# EAGLE design Desain_hardware_GasMeter (EAGLE 9.6.2)
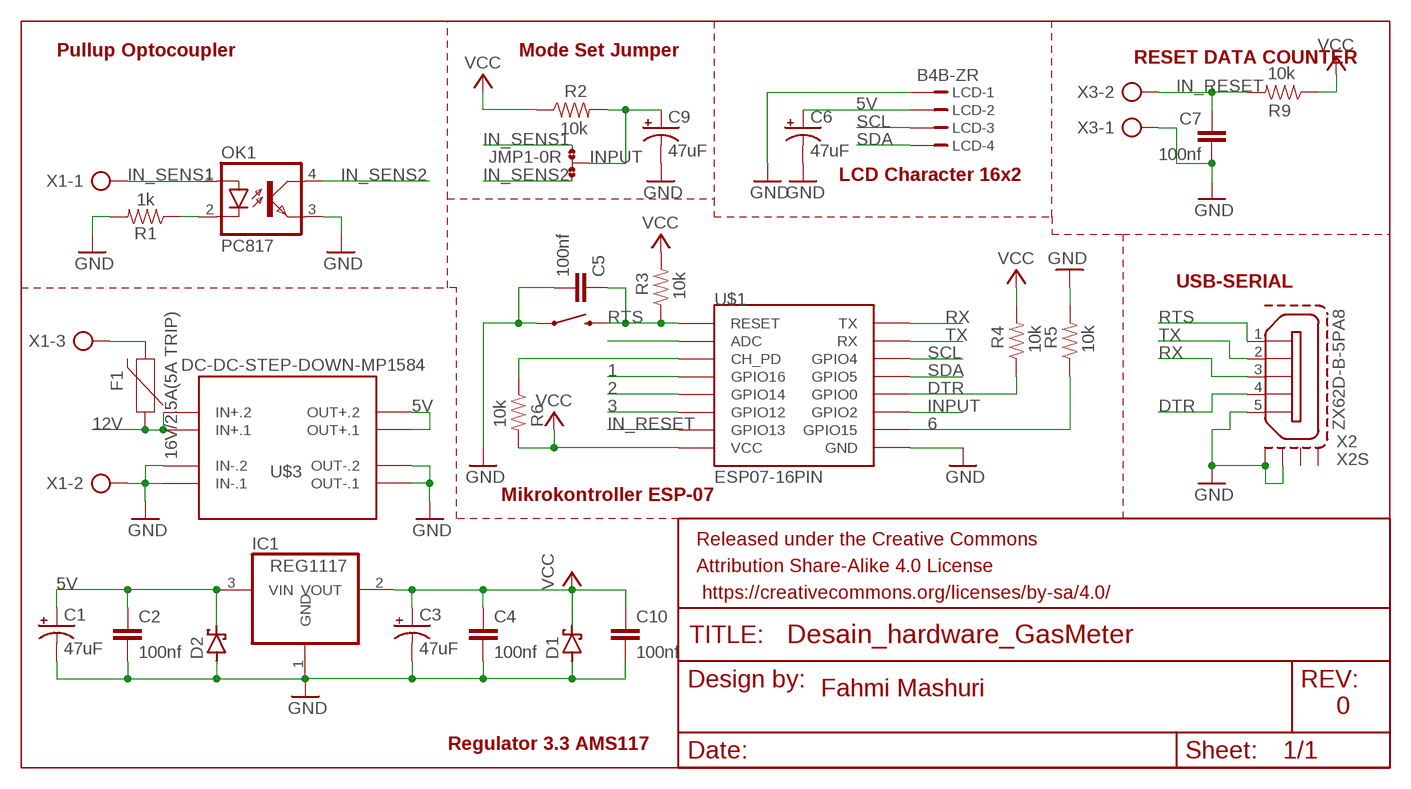
[diagram p0: schematic, sheet 1]

## Parts
C1  47uF  47UF-POLAR-EIA3528-10V-10%  [EIA3528]
C2  100nf  39NF-0805-50V-10%  [0805]
C3  47uF  47UF-POLAR-EIA3528-10V-10%  [EIA3528]
C4  100nf  39NF-0805-50V-10%  [0805]
C5  100nf  39NF-0805-50V-10%  [0805]
C6  47uF  47UF-POLAR-EIA3528-10V-10%  [EIA3528]
C7  100nf  39NF-0805-50V-10%  [0805]
C9  47uF  47UF-POLAR-EIA3528-10V-10%  [EIA3528]
C10  100nf  39NF-0805-50V-10%  [0805]
D1  SCHOTTKY-DIODESMD  [SMB]
D2  SCHOTTKY-DIODESMD  [SMB]
F1  16V/2.5A(5A TRIP)  PPTC_16V_2.5A  [1812]
FRAME1  FRAME-LETTER  [CREATIVE_COMMONS]
IC1  REG1117  [SOT223]
JMP1  0R-JUMPA  [A0R-JMP]
LCD  B4B-ZR  [B4B-ZR]
OK1  PC817  [DIL04]
R1  1k  0.1OHM-1210-1/2W-1%  [1210]
R2  10k  0.3OHM-0805-1/8W-1%  [0805]
R3  10k  0.3OHM-0805-1/8W-1%  [0805]
R4  10k  0.3OHM-0805-1/8W-1%  [0805]
R5  10k  0.3OHM-0805-1/8W-1%  [0805]
R6  10k  0.3OHM-0805-1/8W-1%  [0805]
R9  10k  0.3OHM-0805-1/8W-1%  [0805]
U$1  ESP07-16PIN  [ESP07-16PIN]
U$2  MOMENTARY-SWITCH-SPST-PTH-6.0MM  [TACTILE_SWITCH_PTH_6.0MM]
U$3  DC-DC-STEP-DOWN-MP1584  [DC-DC-STEP-DOWN-MP1584]
X1  AK500/3  [AK500/3]
X2  ZX62D-B-5PA8  [ZX62D-B-5PA8]
X3  AK500/2  [AK500/2]

## Nets
1: U$1.GPIO16
2: U$1.GPIO14
3: U$1.GPIO12
5V: C1.A(+) C2.1 C6.A(+) D2.C IC1.3(VIN) LCD.2 U$3.OUT+.1 U$3.OUT+.2
6: R5.1 U$1.GPIO15
12V: F1.1 U$3.IN+.1 U$3.IN+.2
DTR: R4.1 U$1.GPIO0 X2.4
GND: C1.C(-) C2.2 C3.C(-) C4.2 C5.2 C6.C(-) C7.2 C9.C(-) C10.2 D1.A D2.A IC1.1(GND) LCD.1 OK1.3(EMIT) R1.2 R5.2 U$1.GND U$2.1 U$3.IN-.1 U$3.IN-.2 U$3.OUT-.1 U$3.OUT-.2 X1.2 X2.5 X2.S1 X2.S2 X3.1
IN_RESET: C7.1 R9.2 U$1.GPIO13 X3.2
IN_SENS1: JMP1.1 OK1.1(A) X1.1
IN_SENS2: JMP1.3 OK1.4(COL)
INPUT: C9.A(+) JMP1.2 R2.2 U$1.GPIO2
N$1: R6.1 U$1.CH_PD
N$2: F1.2 X1.3
N$4: OK1.2(C) R1.1
N$10: U$1.ADC
RTS: C5.1 R3.1 U$1.REST(RESET) U$2.3 X2.1
RX: U$1.TX X2.3
SCL: LCD.3 U$1.GPIO4
SDA: LCD.4 U$1.GPIO5
TX: U$1.RX X2.2
VCC: C3.A(+) C4.1 C10.1 D1.C IC1.2(VOUT) R2.1 R3.2 R4.2 R6.2 R9.1 U$1.VCC
Unconnected: X2.S3 X2.S4

## Notes on the sheet
- Pullup Optocoupler | Mode Set Jumper
- RESET DATA COUNTER
- LCD Character 16x2
- USB-SERIAL
- Mikrokontroller ESP-07
- Fahmi Mashuri
- 0
- Regulator 3.3 AMS117

## Library data of the parts
C1 C3 C6 C9 = SparkFun-Capacitors:47UF-POLAR: 47µF polarized capacitors A capacitor is a passive two-terminal electrical component used to store electrical energy temporarily in an electric field.; PROD_ID: CAP-08310
C2 C4 C5 C7 C10 = SparkFun-Capacitors:39NF: 39nF ceramic capacitors A capacitor is a passive two-terminal electrical component used to store electrical energy temporarily in an electric field.; PROD_ID: CAP-15816; VALUE: 39nF
D1 D2 = diode:SCHOTTKY-DIODE: Schottky Diode
F1 = SparkFun-Fuses:PPTC: Resettable Fuse PPTC Resettable Fuse. Really a sort of resistor with a polymeric positive temperature coefficient whose resistance increases dramatically with an increase in temperature. When heated by the power passing through the resistance rises causing the current to be limited, protecting the circuit. This is achieved by the transition of the polymer from a crystalline to an amorphous state where the conductive carbon separates breaking the conductive pathways found in the cool crystalline structure. When a PPTC cools back down it resumes conducting letting the circuit turn back on. SparkFun Products: SparkFun RedBoard - Programmed with Arduino <https://www.sparkfun.com/products/12757> Pro Micro - 5V/16MHz <https://www.sparkfun.com/products/12640> Arduino Pro 328 - 5V/16MHz <https://www.sparkfun.com/products/10915> MP3 Trigger <https://www.sparkfun.com/products/13720>; PROD_ID: RES-14390
FRAME1 = SparkFun-Aesthetics:FRAME-LETTER: Schematic Frame - Letter Standard 8.5x11 US Letter frame
IC1 = burr-brown:REG1117: 800mA and 1A Low Dropout (LDO) Positive Regulator 1.8V, 2.5V, 2.85V, 3.3V, 5V, and Adj; MPN: REG1117; OC_FARNELL: 1097566; OC_NEWARK: 14P6981
JMP1 = jump-0r-smd:0R-JUMP: SMD 0R 0805 Jumper
LCD = con-jst:?4B-ZR: ZH CONNECTOR 1.5 mm, 4 pin 1 row Source: http://www.jst.com .. eZH.pdf; MF: FARNELL; MPN: B4B-ZR(LF)(SN); OC_FARNELL: 1830916; OC_NEWARK: 37K9960
OK1 = optocoupler:PC817: SHARP OPTO COUPLER; MPN: PC817X4J000F; OC_FARNELL: 9707727; OC_NEWARK: 97K7059
R1 = SparkFun-Resistors:0.1OHM: 0.1Ω resistor A resistor is a passive two-terminal electrical component that implements electrical resistance as a circuit element. Resistors act to reduce current flow, and, at the same time, act to lower voltage levels within circuits. - Wikipedia; PROD_ID: RES-12374; VALUE: 0.1
R2-R6 R9 = SparkFun-Resistors:0.3OHM: 0.3Ω resistor A resistor is a passive two-terminal electrical component that implements electrical resistance as a circuit element. Resistors act to reduce current flow, and, at the same time, act to lower voltage levels within circuits. - Wikipedia; PROD_ID: RES-11622; VALUE: 0.3
U$1 = esp8266modules:ESP07-16PIN: ESP8266 Wifi module 07 - 16 pins; DIMENSIONS: 22.0 x 16.0 mm; PINS: 16; PITCH: 0.078" / 2 mm
U$2 = SparkFun-Switches:MOMENTARY-SWITCH-SPST: Momentary Switch (Pushbutton) - SPST Normally-open (NO) SPST momentary switches (buttons, pushbuttons). Variants PTH-12MM - 12mm square, through-hole Momentary Pushbutton Switch - 12mm Square <https://www.sparkfun.com/products/9190> (COM-09190) PTH-6.0MM, PTH-6.0MM-KIT - 6.0mm square, through-hole Mini Pushbutton Switch <https://www.sparkfun.com/products/97> (COM-00097) KIT package intended for soldering kit's - only one side of pads' copper is exposed. PTH-RIGHT-ANGLE-KIT - Right-angle, through-hole Right Angle Tactile Button <https://www.sparkfun.com/products/10791> - Used on SparkFun BigTime Watch Kit <https://www.sparkfun.com/products/11734> SMD-12MM - 12mm square, surface-mount Tactile Button - SMD (12mm) <https://www.sparkfun.com/products/12993> (COM-12993) Used on SparkFun PicoBoard <https://www.sparkfun.com/products/11888> SMD-4.5MM - 4.5mm Square Trackball Switch Used on SparkFun Blackberry Trackballer Breakout <https://www.sparkfun.com/products/13169> SMD-4.6MMX2.8MM - 4.60mm x 2.80mm, surface mount Used on SparkFun SAMD21 Mini Breakout <https://www.sparkfun.com/products/13664> SMD-5.2MM, SMD-5.2-REDUNDANT - 5.2mm square, surface-mount Mini Pushbutton Switch - SMD <https://www.sparkfun.com/products/8720> (COM-08720) Used on Arduino Pro Mini <https://www.sparkfun.com/products/11114> REDUNDANT package connects both switch circuits together SMD-6.0X3.5MM - 6.0 x 3.5mm, surface mount Momentary Reset Switch SMD <https://www.sparkfun.com/products/8229> (COM-08229) SMD-6.2MM-TALL - 6.2mm square, surface mount Tactile Button - SMD (6mm) <https://www.sparkfun.com/products/12992> Used on SparkFun Digital Sandbox <https://www.sparkfun.com/products/12651> SMD-RIGHT-ANGLE - Right-angle, surface mount Used on SparkFun Block for Intel® Edison - Arduino <https://www.sparkfun.com/products/13036>; PROD_ID: SWCH-08441; SF_SKU: COM-00097
U$3 = diy-modules:DC-DC-STEP-DOWN-MP1584: DC/DC Step-Down Regulator based on MP1584 chip MP1584 datasheet available here: http://www.haoyuelectronics.com/Attachment/MP1584/MP1584.pdf Click here to find device on ebay.com <http://www.ebay.com/sch/mp1584+module>
X1 = con-ptr500:AK500/3: CONNECTOR; OC_FARNELL: unknown; OC_NEWARK: unknown
X2 = zx62d-b-5pa8-oshpark_10:ZX62D-B-5PA8: Micro USB Type B Connector - Standard, Shell Through Hole Source: http://www.hirose.co.jp/cataloge_hp/ed_ZX_20140804.pdf; MF: Hirose; MPN: ZX62D-B-5PA8; OC_FARNELL: 2300438; OC_NEWARK: 69W0712
X3 = con-ptr500:AK500/2: CONNECTOR; OC_FARNELL: unknown; OC_NEWARK: unknown

## Board
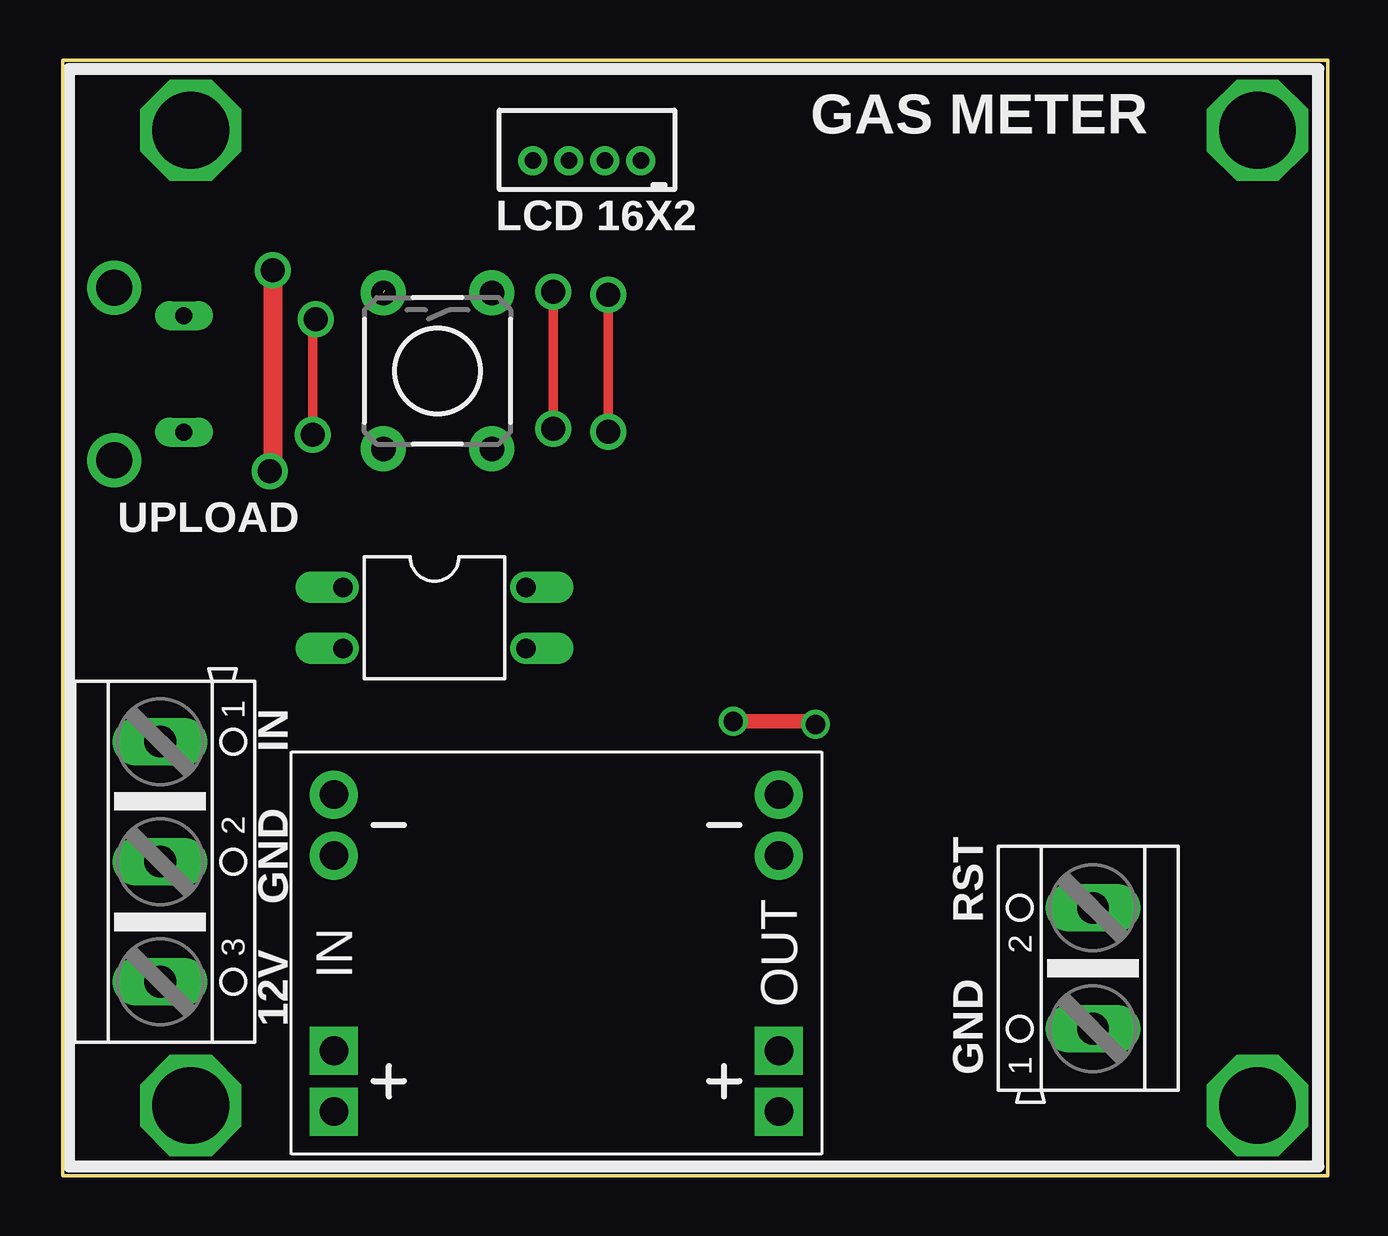
[diagram p1: board, top side]
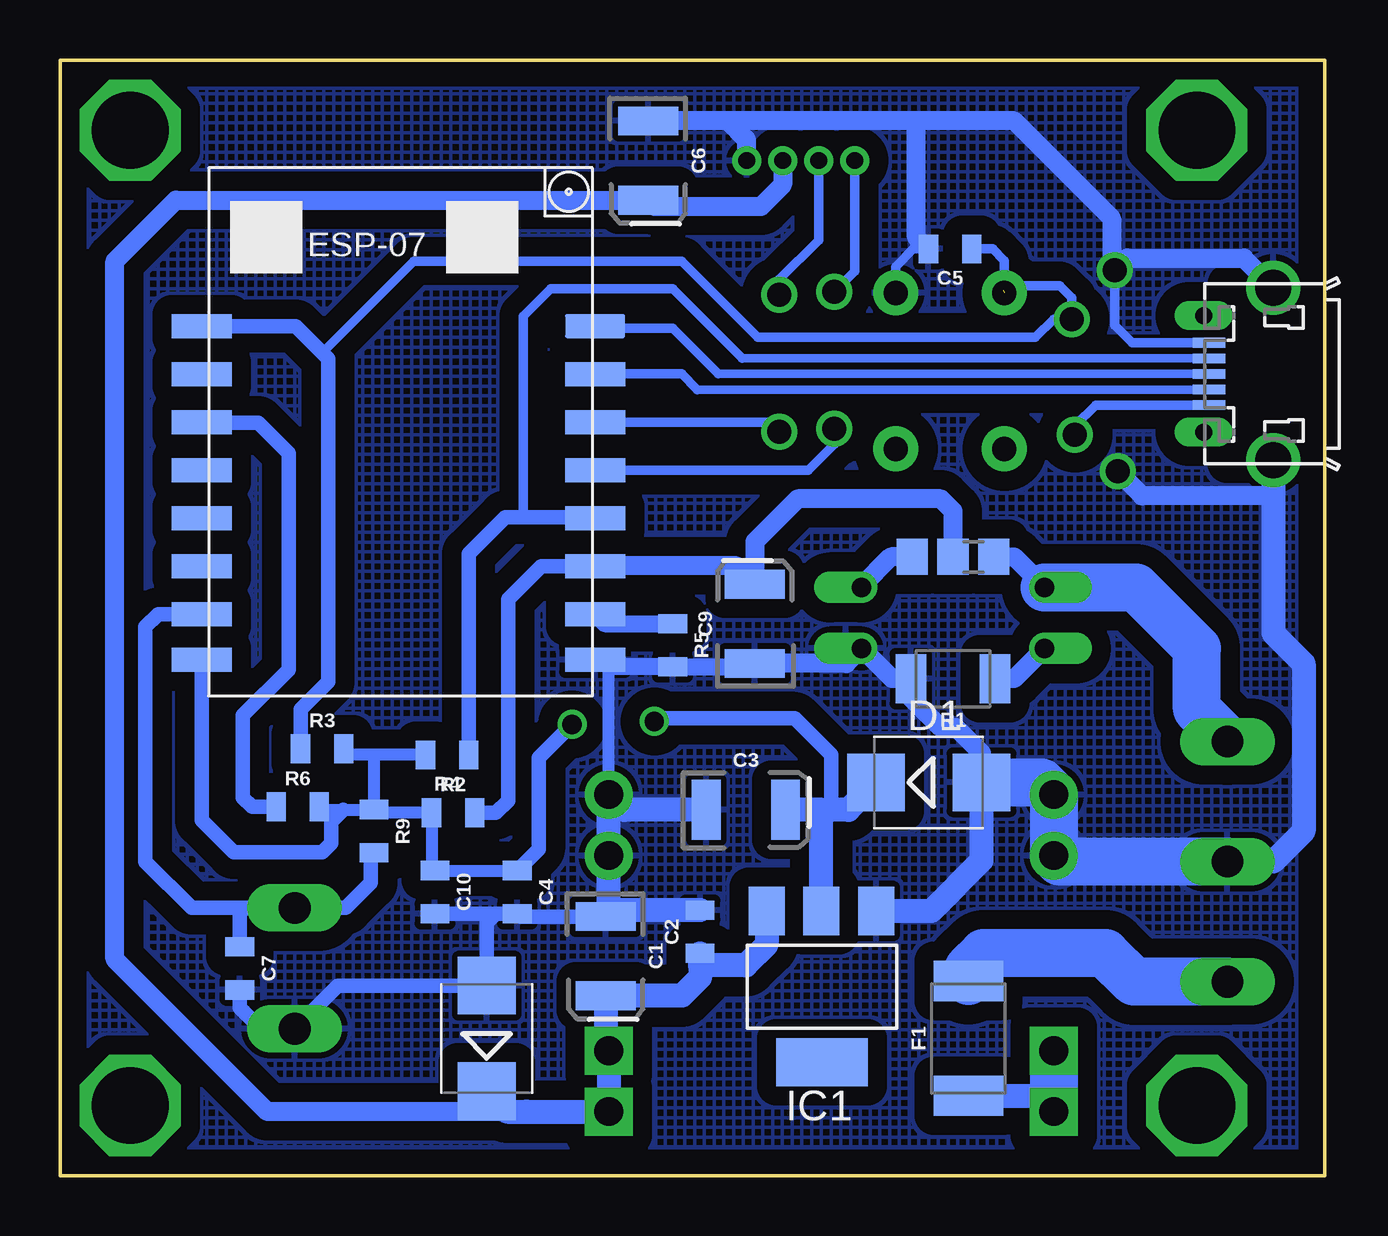
[diagram p2: board, bottom side, seen from below]

Size 52.7 x 46.48 mm. Coordinates in mm from the lower left corner, seen from the top.
Outline: 0,0 52.7,0 52.7,46.48 0,46.48 0,0
Copper layers (1*16): Top 0.035mm / dielectric 0.15mm / Bottom 0.035mm
Design rules "default": minimum track width 6mil, minimum drill 0.35mm, track to track 6mil, track to pad 6mil, pad to pad 6mil, via to via 6mil, smd to smd 6mil, copper to edge 40mil, drill to drill 6mil, minimum pad ring 10mil, minimum via ring 8mil, stop-mask expansion 4mil, vias tented up to drill 0mil, thermal gap 10mil

### Footprints (pad centres in the part's own frame; a part is rotated, then mirrored left to right if it is on the bottom)
EIA3528 = smd 1.2 x 2.5: A 1.65,0; C -1.65,0
0805 = smd 0.8 x 1.2: 1 -0.9,0; 2 0.9,0
SMB = smd 2.4 x 2.4: A 2.2,0; C -2.2,0
1812 = smd 1.676 x 2.896: 1 -2.388,0; 2 2.388,0
SOT223 = smd 1.499 x 2.007: 1 -2.261,-3.15; 2 0.025,-3.15; 3 2.311,-3.15 | smd 3.81 x 2.007: 4 0,3.15
A0R-JMP = smd 1.5 x 1.3: 1 0,1.7; 2 0,0; 3 0,-1.7
B4B-ZR = drill 0.7 pad 1.1: 1 -2.25,0; 2 -0.75,0; 3 0.75,0; 4 2.25,0
DIL04 = drill 0.813 offset: 1 -1.27,-3.81; 2 1.27,-3.81; 3 1.27,3.81; 4 -1.27,3.81
1210 = smd 1.27 x 2.06: 1 -1.755,0; 2 1.755,0
ESP07-16PIN = smd 2.5 x 1: ADC -8.2,3.8; CH_PD -8.2,1.8; GND 8.2,-8.105; GPIO0 8.2,-2.2; GPIO2 8.2,-4.2; GPIO4 8.2,1.8; GPIO5 8.2,-0.2; GPIO12 -8.2,-4.2; GPIO13 -8.2,-6.2; GPIO14 -8.2,-2.2; GPIO15 8.2,-6.2; GPIO16 -8.2,-0.2; REST -8.2,5.8; RX 8.2,3.8; TX 8.2,5.8; VCC -8.2,-8.105
TACTILE_SWITCH_PTH_6.0MM = drill 1.016 pad 1.88: 1 -3.251,2.261; 2 3.251,2.261; 3 -3.251,-2.261; 4 3.251,-2.261
DC-DC-STEP-DOWN-MP1584 = drill 1.2 pad 2 square: IN+.1 -9.271,-4.064; IN+.2 -9.271,-6.604; OUT+.1 9.271,-4.064; OUT+.2 9.271,-6.604 | drill 1.2 pad 2: IN-.1 -9.271,6.604; IN-.2 -9.271,4.064; OUT-.1 9.271,6.604; OUT-.2 9.271,4.064
AK500/3 = drill 1.321 long: 1 -5.004,0; 2 0,0; 3 5.004,0
ZX62D-B-5PA8 = smd 1.35 x 0.4: 1 4.825,1.3; 2 4.825,0.65; 3 4.825,0; 4 4.825,-0.65; 5 4.825,-1.3 | drill 1.5: S1 2.15,-3.6; S2 2.15,3.6 | drill 0.7 long: S3 5.05,2.425; S4 5.05,-2.425
AK500/2 = drill 1.321 long: 1 -2.515,0; 2 2.515,0

### Placement (x,y rotation side)
C1  29.97,9.14 270 bottom
C2  26.04,10.16 90 bottom
C3  24.13,15.24 0 bottom
C4  33.66,11.81 270 bottom
C5  15.62,38.61 180 bottom
C6  28.19,42.29 270 bottom
C7  45.21,8.64 270 bottom
C9  23.75,22.99 90 bottom
C10  37.08,11.81 270 bottom
D1  16.51,16.38 0 bottom
D2  34.92,5.71 90 bottom
F1  14.86,5.71 90 bottom
FRAME1  6.6,-8.51 0 top  (outside the outline)
IC1  20.96,7.87 180 bottom
JMP1  15.49,25.78 270 bottom
LCD  21.84,42.29 180 top
OK1  15.49,23.24 270 top
R1  15.49,20.7 180 bottom
R2  36.32,15.11 0 bottom
R3  41.78,17.78 0 bottom
R4  36.58,17.53 180 bottom
R5  27.18,22.1 270 bottom
R6  42.8,15.37 0 bottom
R9  39.62,14.35 270 bottom
U$1  38.61,29.59 0 bottom
U$2  15.62,33.53 270 top
U$3  20.57,9.27 0 top
X1  4.06,13.08 270 top
X2  0,33.4 180 bottom
X3  42.93,8.64 90 top

### Tracks (layer width: path | path; a pad name or v marks a point on that pad's centre or on a via)
5V
  Bottom 0.8: 33.27,2.67 44.07,2.67 50.42,9.02 50.42,38.1 47.88,40.64 C6.A 27.94,40.39 23.5,40.39 22.59,41.29 LCD.2
  Bottom 1: D2.C 34.08,2.67 33.27,2.67 U$3.OUT+.2 U$3.OUT+.1 29.97,5.33 C1.A 26.8,7.49 26.04,8.25 26.04,8.76 | C2.1 26.04,8.76 | IC1.3 23.27,9.63 24.13,8.76 26.04,8.76
6
  Bottom 0.7: U$1.GPIO15 30.02,23 R5.1
12V
  Bottom 1: F1.1 12.09,3.33 11.43,2.67 U$3.IN+.2
  Bottom 2: U$3.IN+.1 U$3.IN+.2
DTR
  Bottom 0.35: X2.4 24.27,34.05
  Bottom 0.4: 33.4,27.43 33.4,35.81 32.26,36.96 27.18,36.96 24.27,34.05
  Bottom 0.6: R4.1 35.68,25.92 34.16,27.43 33.4,27.43 31.12,27.43 30.86,27.18 30.62,27.18 U$1.GPIO0
GND  (via drill 1)
  Top 0.8: v8.76,37.72 8.76,29.46 v8.64,29.34
  Bottom 0.4: X2.5 8.03,34.7 8.76,35.43 8.76,38.1 8.64,38.23 3.38,38.23 | U$2.1 17.88,37.87 17.14,38.61 C5.2
  Bottom 0.5: U$3.OUT-.1 29.85,21.07 29.72,21.2 29.46,21.45
  Bottom 0.6: C1.C 33.54,10.79 C4.2 34.54,10.91 | 34.54,10.91 C10.2 | 34.54,10.91 34.92,10.53 D2.A 41.13,7.92 X3.1 44.35,6.12 45.21,6.99 C7.2
  Bottom 0.7: 29.72,21.2 R5.2 23.89,21.2 C9.C | 29.46,21.45 30.37,21.45 U$1.GND
  Bottom 0.8: D1.A 14.31,17.61 15.37,18.67 16,18.67 17.25,19.92 R1.2 18.03,20.7 OK1.3 19.94,21.34 C9.C | 24.89,43.94 C6.C | LCD.1 24.09,43.14 24.89,43.94 | v8.64,29.34 7.62,28.32 2.15,28.32 | 17.02,43.94 12.95,43.94 8.89,39.88 8.89,37.85 v8.76,37.72 8.25,38.23 3.38,38.23 X2.S1 | 17.02,43.94 24.89,43.94 | C5.2 17.02,39.1 17.02,43.94
  Bottom 1: D1.A 14.31,13.12 16.41,11.02 IC1.1 | C3.C 29.21,15.24 U$3.OUT-.1 U$3.OUT-.2 29.85,10.92 C1.C 29.71,11.06 C2.2 | X2.S2 2.15,28.32 2.15,22.6 0.89,21.34 0.89,14.35 2.16,13.08 X1.2
  Bottom 2: X1.2 11.05,13.08 U$3.IN-.2 U$3.IN-.1 11.81,16.38 D1.A
  pour Bottom (isolate 0.8, hatched): 0.25,0.38 52.32,0.38 52.32,46.1 0.25,46.1
IN_RESET
  Bottom 0.6: R9.2 39.75,13.32 39.75,12.19 40.79,11.15 X3.2 | X3.2 44.98,11.15 45.21,10.92 C7.1 | U$1.GPIO13 48.62,23.39 49.15,22.86 49.15,13.08 47.22,11.15 X3.2
IN_SENS1
  Bottom 0.8: JMP1.1 12.95,25.78 OK1.1
  Bottom 2: OK1.1 7.87,24.51 5.33,21.97 5.33,19.43 4.06,18.16 X1.1
IN_SENS2
  Bottom 0.8: JMP1.3 18.08,25.78 19.3,24.56 OK1.4
INPUT
  Bottom 0.6: R2.2 34.54,15.11 34.04,15.62 34.04,24 32.65,25.39 U$1.GPIO2
  Bottom 0.8: JMP1.2 15.49,27.69 16,28.19 21.97,28.19 23.75,26.42 C9.A 24.51,25.4 U$1.GPIO2
N$1
  Bottom 0.6: R6.1 44.7,15.37 45.09,15.75 45.09,19.18 43.18,21.08 43.18,30.1 44.45,31.37 46.79,31.37 U$1.CH_PD
N$2
  Bottom 2: X1.3 7.95,8.08 9.14,9.27 14.22,9.27 14.86,8.64 F1.2
N$3  (via drill 3.2)
  other vias: 5.33,2.92
N$4
  Bottom 0.8: OK1.2 12.95,20.7 R1.1
N$5  (via drill 3.2)
  other vias: 49.78,2.92
N$6  (via drill 3.2)
  other vias: 49.78,43.56
N$7  (via drill 3.2)
  other vias: 5.33,43.56
RTS  (via drill 1)  (1 unrouted)
  Top 0.4: v10.54,35.69 10.41,35.56 v10.41,30.86
  Bottom 0.4: X2.1 9.55,32.1 10.41,31.24 v10.41,30.86 | 13.4,36.89 13.21,37.08 11.05,37.08 10.54,36.58 v10.54,35.69 11.3,35.69 12.06,34.92 23.62,34.92 26.8,38.1 37.97,38.1 41.78,34.29 | U$2.3 13.36,38.12 13.84,38.61 C5.1
  Bottom 0.6: R3.1 42.68,19.42 41.53,20.57 41.53,34.04 41.78,34.29 42.88,35.39 U$1.REST
RX
  Bottom 0.35: X2.3 25.27,33.4
  Bottom 0.4: U$1.TX 30.32,35.31 27.18,35.31 25.27,33.4
SCL  (via drill 1)
  Top 0.4: v22.73,30.99 v22.73,36.7
  Bottom 0.4: U$1.GPIO4 23.14,31.39 v22.73,30.99 | v22.73,36.7 22.73,37.34 21.09,38.98 LCD.3
SDA  (via drill 1)
  Top 0.4: v20.45,31.12 v20.45,36.83
  Bottom 0.4: U$1.GPIO5 21.54,29.39 20.45,30.48 v20.45,31.12 | v20.45,36.83 19.59,37.68 LCD.4
TX
  Bottom 0.35: X2.2 26.15,32.75
  Bottom 0.4: 26.15,32.75 26.8,33.4 U$1.RX
VCC  (via drill 0.8)
  Top 0.6: v27.94,18.92 31.24,18.92 v31.37,18.8
  Bottom 0.5: R9.1 39.49,15.11 R2.1 37.22,12.85 C10.1 C4.1 | R4.2 39.62,17.53 | 39.62,17.53 40.63,17.53 R3.2 | R6.2 41.78,15.25 40.89,15.25 R9.1 | 39.62,17.53 R9.1
  Bottom 0.6: 20.57,15.24 20.57,17.53 22.1,19.05 27.81,19.05 v27.94,18.92 | v31.37,18.8 32.77,17.4 32.77,13.6 C4.1 | 40.89,15.25 41.4,14.74 41.4,13.84 41.78,13.46 45.47,13.46 46.81,14.8 U$1.VCC
  Bottom 1: D1.C 19.85,15.24 20.57,15.24 20.96,15.24 | 20.96,15.24 C3.A | IC1.2 20.98,15.21 20.96,15.24

### Text on the board
tPlace: GAS METER | LCD 16X2 | UPLOAD | IN | GND | RST | 12V | GND